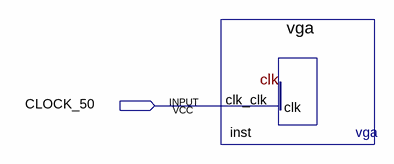
[diagram p0: schematic sheet]
// Quartus schematic vga_test.bdf as structural Verilog: 1 symbols, 1 pins
module vga_test (
  input  CLOCK_50
);

  vga inst (.clk_clk(CLOCK_50));
endmodule
